# EasyEDA Pro project ProPrj_Hitboard PCB v2_left_2026-01-14.epro

# Board PCB1
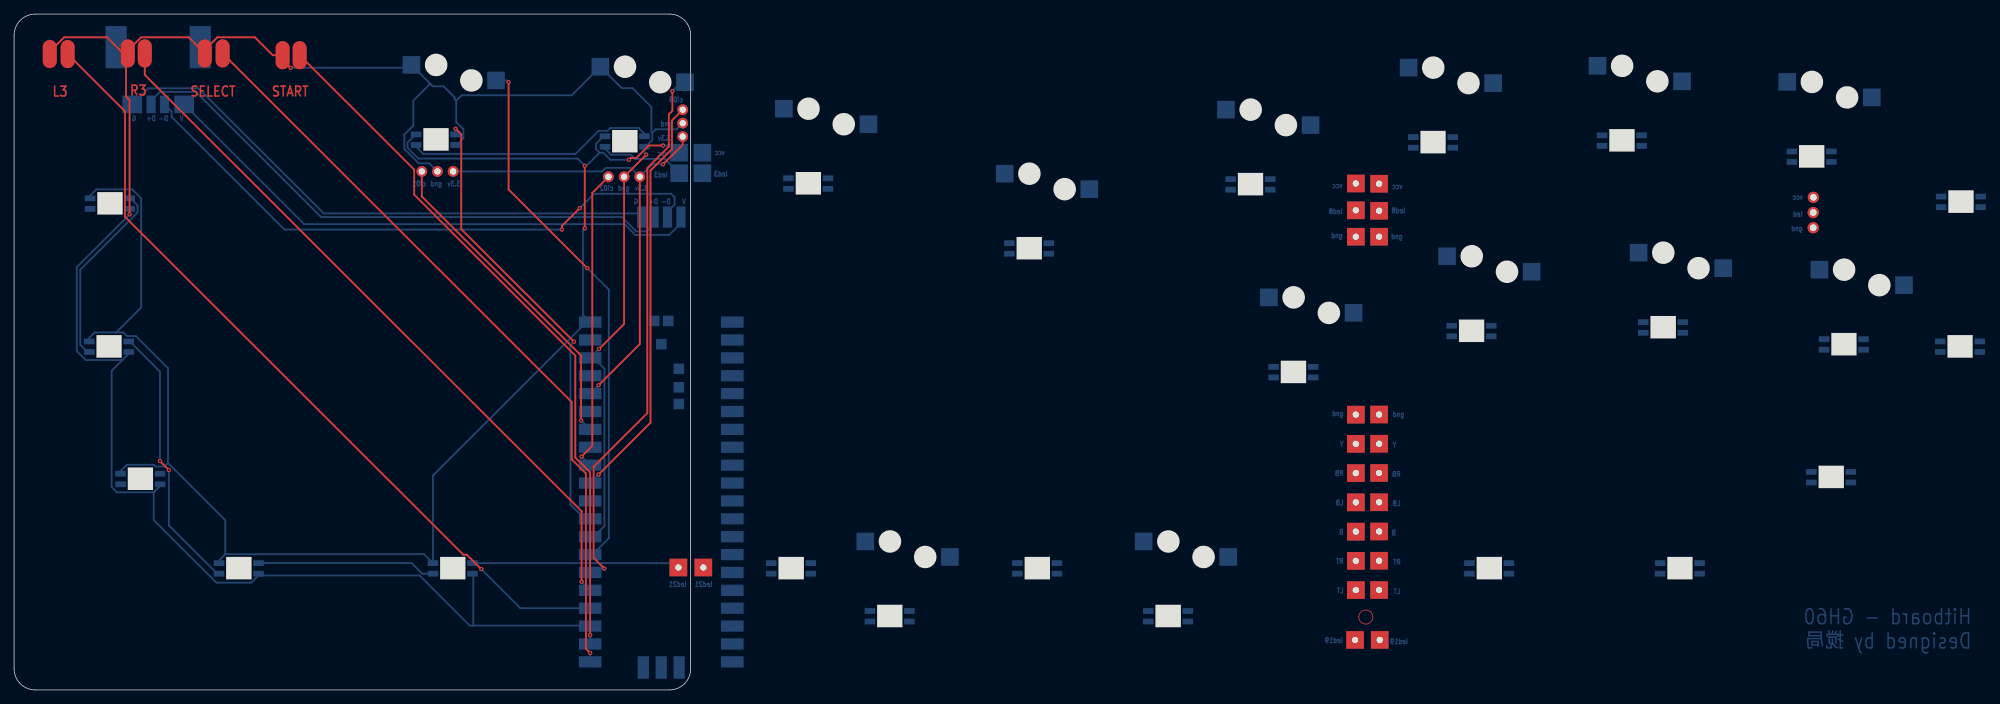
[diagram p0: board, top side]
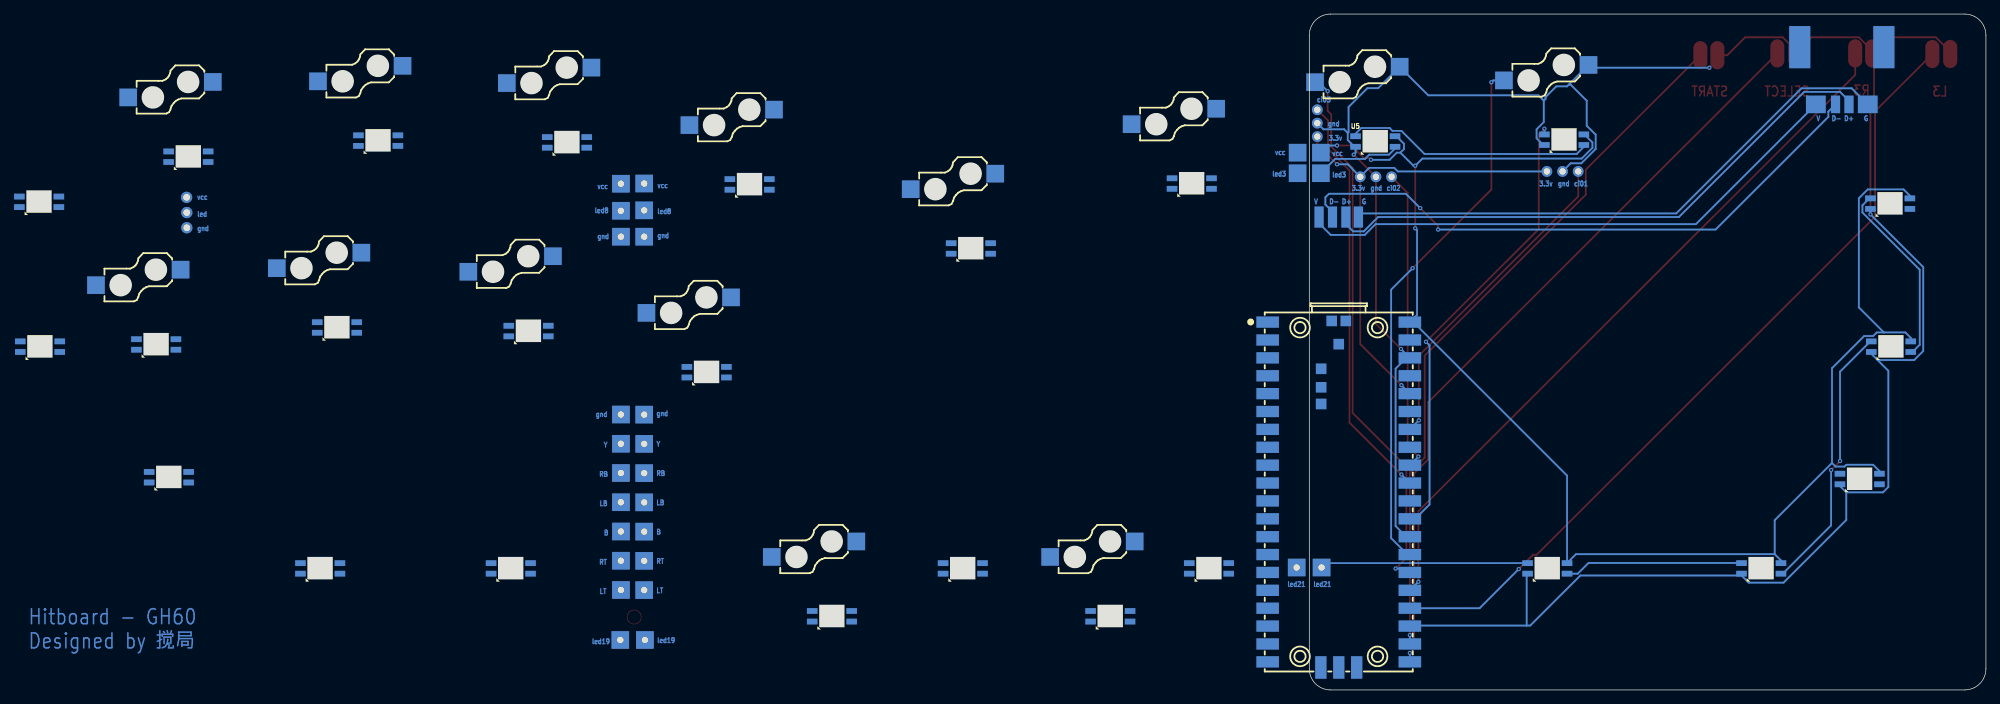
[diagram p1: board, bottom side, seen from below]

Outline 278.04 x 96 mm; copper layers: Top Layer, Bottom Layer. Coordinates in mm from the lower left corner of the outline.
Outline path: 0,93 0,3 arc(0.88,0.88) 3,0 93,0 arc(95.12,0.88) 96,3 96,93 arc(95.12,95.12) 93,96 3,96 arc(0.88,95.12) 0,93
Stack: Top Layer 0.035mm / Dielectric1 1.51mm FR4 er 4.5 / Bottom Layer 0.035mm

## Design rules (mm)
template: JLCPCB Capability(Two Layers Board)
spacing copperThickness1oz (default): track to track 0.102, other pairs 0.152 to 0.3
spacing copperThickness2oz: track to track 0.203, other pairs 0.152 to 0.3
track width copperThickness1oz (default): min 0.127, default 0.254, max 2.54
track width copperThickness2oz: min 0.203, default 0.254, max 2.54
differential pair differentialPair (default): width min 0.127, default 0.254, max 2.54; gap min 0.152, default 0.152
via viaSize (default): diameter min 0.5, default 0.61, max 10; hole min 0.3, default 0.305, max 6.3

## Placement (name value [footprint] x y rotation side)
NOREF  -  [Pad_e6738]  94.36 73.39 0 top
NOREF#2  -  [Pad_e13604]  190.37 30.8 0 top
NOREF#3  -  [Pad_e685]  21.34 83.17 180 top
NOREF#4  -  [Pad_e680]  29.59 90.41 0 top
NOREF#5  -  [Pad_e296]  60.07 73.65 0 top
NOREF#6  -  [Pad_e675]  5.06 90.32 0 top
NOREF#7  -  [Pad_e691]  90.81 67.17 180 top
NOREF#8  -  [Pad_e61147]  255.27 67.81 0 top
NOREF#9  -  [Pad_e677]  16.13 90.41 0 top
NOREF#10  -  [Pad_e13637]  193.68 71.9 0 top
NOREF#11  -  [Pad_e297]  57.85 73.65 0 top
NOREF#12  -  [Pad_e300]  94.87 80.51 0 top
NOREF#13  -  [Pad_e13608]  190.37 14.18 0 top
NOREF#14  -  [Pad_e678]  18.54 90.41 0 top
NOREF#15  -  [Pad_e73]  193.68 18.35 0 top
NOREF#16  -  [Pad_e687]  97.66 76.31 0 top
NOREF#17  -  [Pad_e13606]  190.37 22.49 0 top
NOREF#18  -  [Pad_e13605]  190.37 26.64 0 top
NOREF#19  -  [Pad_e6737]  97.66 73.39 0 top
NOREF#20  -  [Pad_e13607]  190.37 18.33 0 top
NOREF#21  -  [Pad_e13636]  193.68 64.38 0 top
NOREF#22  -  [Pad_e74]  193.68 14.2 0 top
NOREF#23  -  [Pad_e114539]  190.37 39.1 0 top
NOREF#24  -  [Pad_e686]  24.13 83.17 180 top
NOREF#25  -  [Pad_e4881]  97.79 17.39 0 top
NOREF#26  -  [Pad_e4875]  193.76 7.1 0 top
NOREF#27  -  [Pad_e693]  92.71 67.17 180 top
NOREF#28  -  [Pad_e681]  38.1 90.16 0 top
NOREF#29  -  [Pad_e71]  193.68 26.66 0 top
NOREF#30  -  [Pad_e70]  193.68 30.81 0 top
NOREF#31  -  [Pad_e301]  94.87 82.41 0 top
NOREF#32  -  [Pad_e294]  86.55 72.89 0 top
NOREF#33  -  [Pad_e46]  88.77 72.89 0 top
NOREF#34  -  [Pad_e676]  7.6 90.32 0 top
NOREF#35  -  [Pad_e4879]  94.26 17.39 0 top
NOREF#36  -  [Pad_e53994]  26.42 91.3 180 top
NOREF#37  -  [Pad_e48]  84.33 72.89 0 top
NOREF#38  -  [Pad_e13635]  193.68 68.06 0 top
NOREF#39  -  [Pad_e61148]  255.27 65.65 0 top
NOREF#40  -  [Pad_e299]  94.87 78.6 0 top
NOREF#41  -  [Pad_e68]  193.68 39.12 0 top
NOREF#42  -  [Pad_e689]  89.03 67.17 180 top
NOREF#43  -  [Pad_e684]  19.43 83.17 180 top
NOREF#44  -  [Pad_e13601]  190.37 68.12 0 top
NOREF#45  -  [Pad_e6736]  94.36 76.31 0 top
NOREF#46  -  [Pad_e295]  62.29 73.65 0 top
NOREF#47  -  [Pad_e61146]  255.3 69.97 0 top
NOREF#48  -  [Pad_e682]  40.51 90.16 0 top
NOREF#49  -  [Pad_e53995]  14.48 91.3 180 top
NOREF#50  -  [Pad_e72]  193.68 22.5 0 top
NOREF#51  -  [Pad_e683]  16.76 83.17 180 top
NOREF#52  -  [Pad_e4877]  190.27 7.1 0 top
NOREF#53  -  [Pad_e13600]  190.37 71.93 0 top
NOREF#54  -  [Pad_e679]  27.05 90.41 0 top
NOREF#55  -  [Pad_e13603]  190.37 34.95 0 top
NOREF#56  -  [Pad_e694]  94.61 67.17 180 top
NOREF#57  -  [Pad_e13602]  190.37 64.38 0 top
NOREF#58  -  [Pad_e69]  193.68 34.97 0 top
U1  PICO  [COMM-SMD_L51.0-W21.0-P2.54_SC0916]  91.82 27.8 270 bottom
U5  -  [LED-SMD_L3.2-W2.8_YO-WS2812B-3528]  163.73 10.46 180 bottom
U5#2  -  [LED-SMD_L3.2-W2.8_YO-WS2812B-3528]  144.02 62.7 180 bottom
U5#3  -  [LED-SMD_L3.2-W2.8_YO-WS2812B-3528]  276.23 69.33 180 bottom
U5#4  -  [LED-SMD_L3.2-W2.8_YO-WS2812B-3528]  276.1 48.76 180 bottom
U5#5  -  [LED-SMD_L3.2-W2.8_YO-WS2812B-3528]  257.81 30.21 180 bottom
U5#6  -  [LED-SMD_L3.2-W2.8_YO-WS2812B-3528]  209.3 17.26 180 bottom
U5#7  -  [LED-SMD_L3.2-W2.8_YO-WS2812B-3528]  145.16 17.26 180 bottom
U5#8  -  [LED-SMD_L3.2-W2.8_YO-WS2812B-3528]  110.24 17.26 180 bottom
U5#9  -  [LED-SMD_L3.2-W2.8_YO-WS2812B-3528]  62.23 17.26 180 bottom
U5#10  -  [LED-SMD_L3.2-W2.8_YO-WS2812B-3528]  31.88 17.26 180 bottom
U5#11  -  [LED-SMD_L3.2-W2.8_YO-WS2812B-3528]  13.46 48.76 180 bottom
U5#12  -  [LED-SMD_L3.2-W2.8_YO-WS2812B-3528]  13.59 69.08 180 bottom
U5#13  -  [LED-SMD_L3.2-W2.8_YO-WS2812B-3528]  17.91 29.96 180 bottom
U5#14  -  [LED-SMD_L3.2-W2.8_YO-WS2812B-3528]  236.35 17.26 180 bottom
U5#15  -  [LED-SMD_L3.2-W2.8_YO-WS2812B-3528]  59.84 78.15 180 bottom
U5#16  -  [LED-SMD_L3.2-W2.8_YO-WS2812B-3528]  86.64 77.9 180 bottom
U5#17  -  [LED-SMD_L3.2-W2.8_YO-WS2812B-3528]  112.68 71.93 180 bottom
U5#18  -  [LED-SMD_L3.2-W2.8_YO-WS2812B-3528]  124.23 10.46 180 bottom
U5#19  -  [LED-SMD_L3.2-W2.8_YO-WS2812B-3528]  175.41 71.8 180 bottom
U5#20  -  [LED-SMD_L3.2-W2.8_YO-WS2812B-3528]  181.51 45.13 180 bottom
U5#21  -  [LED-SMD_L3.2-W2.8_YO-WS2812B-3528]  201.32 77.77 180 bottom
U5#22  -  [LED-SMD_L3.2-W2.8_YO-WS2812B-3528]  206.78 50.97 180 bottom
U5#23  -  [LED-SMD_L3.2-W2.8_YO-WS2812B-3528]  228.12 78.03 180 bottom
U5#24  -  [LED-SMD_L3.2-W2.8_YO-WS2812B-3528]  233.96 51.48 180 bottom
U5#25  -  [LED-SMD_L3.2-W2.8_YO-WS2812B-3528]  255.04 75.74 180 bottom
U5#26  -  [LED-SMD_L3.2-W2.8_YO-WS2812B-3528]  259.62 49.07 180 bottom
U6  -  [CONN-SMD_HOTPLUGPAKAGE__C9900010116-1]  146.56 72.23 180 bottom
U6#2  -  [CONN-SMD_HOTPLUGPAKAGE__C9900010116-1]  62.38 87.68 180 bottom
U6#3  -  [CONN-SMD_HOTPLUGPAKAGE__C9900010116-1]  89.18 87.42 180 bottom
U6#4  -  [CONN-SMD_HOTPLUGPAKAGE__C9900010116-1]  115.22 81.45 180 bottom
U6#5  -  [CONN-SMD_HOTPLUGPAKAGE__C9900010116-1]  126.77 19.99 180 bottom
U6#6  -  [CONN-SMD_HOTPLUGPAKAGE__C9900010116-1]  166.27 19.99 180 bottom
U6#7  -  [CONN-SMD_HOTPLUGPAKAGE__C9900010116-1]  177.95 81.33 180 bottom
U6#8  -  [CONN-SMD_HOTPLUGPAKAGE__C9900010116-1]  184.05 54.66 180 bottom
U6#9  -  [CONN-SMD_HOTPLUGPAKAGE__C9900010116-1]  203.86 87.3 180 bottom
U6#10  -  [CONN-SMD_HOTPLUGPAKAGE__C9900010116-1]  209.32 60.5 180 bottom
U6#11  -  [CONN-SMD_HOTPLUGPAKAGE__C9900010116-1]  230.66 87.55 180 bottom
U6#12  -  [CONN-SMD_HOTPLUGPAKAGE__C9900010116-1]  236.5 61.01 180 bottom
U6#13  -  [CONN-SMD_HOTPLUGPAKAGE__C9900010116-1]  257.58 85.27 180 bottom
U6#14  -  [CONN-SMD_HOTPLUGPAKAGE__C9900010116-1]  262.16 58.59 180 bottom

## Footprints (pads in the part's own frame, mm; a bottom-side part is the same pattern mirrored in y, then rotated)
COMM-SMD_L51.0-W21.0-P2.54_SC0916
  rect 1.6x3.2 smd: 1(-24.445,-10.088) 2(-21.905,-10.088) 3(-19.365,-10.088) 4(-16.825,-10.088) 5(-14.285,-10.088) 6(-11.745,-10.088) 7(-9.205,-10.088) 8(-6.665,-10.088) 9(-4.125,-10.088) 10(-1.585,-10.088) 11(0.955,-10.088) 12(3.495,-10.088) 13(6.035,-10.088) 14(8.575,-10.088) 15(11.115,-10.088) 16(13.655,-10.088) 17(16.195,-10.088) 18(18.735,-10.088) 19(21.275,-10.088) 20(23.815,-10.088) 21(23.815,10.088) 22(21.275,10.088) 23(18.735,10.088) 24(16.195,10.088) 25(13.655,10.088) 26(11.115,10.088) 27(8.575,10.088) 28(6.035,10.088) 29(3.495,10.088) 30(0.955,10.088) 31(-1.585,10.088) 32(-4.125,10.088) 33(-6.665,10.088) 34(-9.205,10.088) 35(-11.745,10.088) 36(-14.285,10.088) 37(-16.825,10.088) 38(-19.365,10.088) 39(-21.905,10.088) 40(-24.445,10.088)
  rect 3.2x1.6 smd: 41(24.615,-2.54) 42(24.615,0) 43(24.615,2.54)
  rect 1.5x1.5 smd: TP1(-21.315,0) TP2(-24.615,1) TP3(-24.615,-1) TP4(-17.815,-2.5) TP5(-15.188,-2.5) TP6(-12.815,-2.5)
CONN-SMD_HOTPLUGPAKAGE__C9900010116-1
  rect 2.5x2.5 smd: 1(-6,-1.1) 2(6,1.1)
LED-SMD_L3.2-W2.8_YO-WS2812B-3528
  rect 1.5x0.82 smd: 1(2.8,0.75) 2(2.8,-0.75) 3(-2.8,-0.75) 4(-2.8,0.75)
Pad_e46
  round 1.524 hole 0.914: 1(0,0)
Pad_e48
  round 1.524 hole 0.914: 1(0,0)
Pad_e68
  rect 2.5x2.5 hole 0.9: PTH(0,0)
Pad_e69
  rect 2.5x2.5 hole 0.9: PTH(0,0)
Pad_e70
  rect 2.5x2.5 hole 0.9: PTH(0,0)
Pad_e71
  rect 2.5x2.5 hole 0.9: PTH(0,0)
Pad_e72
  rect 2.5x2.5 hole 0.9: PTH(0,0)
Pad_e73
  rect 2.5x2.5 hole 0.9: PTH(0,0)
Pad_e74
  rect 2.5x2.5 hole 0.9: PTH(0,0)
Pad_e294
  round 1.524 hole 0.914: 1(0,0)
Pad_e295
  round 1.524 hole 0.914: 1(0,0)
Pad_e296
  round 1.524 hole 0.914: 1(0,0)
Pad_e297
  round 1.524 hole 0.914: 1(0,0)
Pad_e299
  round 1.524 hole 0.914: 1(0,0)
Pad_e300
  round 1.524 hole 0.914: 1(0,0)
Pad_e301
  round 1.524 hole 0.914: 1(0,0)
Pad_e675
  oval 2x4 smd: 1(0,0)
Pad_e676
  oval 2x4 smd: 1(0,0)
Pad_e677
  oval 2x4 smd: 1(0,0)
Pad_e678
  oval 2x4 smd: 1(0,0)
Pad_e679
  oval 2x4 smd: 1(0,0)
Pad_e680
  oval 2x4 smd: 1(0,0)
Pad_e681
  oval 2x4 smd: 1(0,0)
Pad_e682
  oval 2x4 smd: 1(0,0)
Pad_e683
  rect 2.8x2.5 smd far side: PTH(0,0)
Pad_e684
  rect 1.3x2.5 smd far side: PTH(0,0)
Pad_e685
  rect 1.3x2.5 smd far side: PTH(0,0)
Pad_e686
  rect 2.8x2.5 smd far side: PTH(0,0)
Pad_e687
  rect 2.5x2.5 smd far side: PTH(0,0)
Pad_e689
  rect 1.3x3 smd far side: PTH(0,0)
Pad_e691
  rect 1.3x3 smd far side: PTH(0,0)
Pad_e693
  rect 1.3x3 smd far side: PTH(0,0)
Pad_e694
  rect 1.3x3 smd far side: PTH(0,0)
Pad_e4875
  rect 2.5x2.5 hole 0.9: PTH(0,0)
Pad_e4877
  rect 2.5x2.5 hole 0.9: PTH(0,0)
Pad_e4879
  rect 2.5x2.5 hole 0.9: PTH(0,0)
Pad_e4881
  rect 2.5x2.5 hole 0.9: PTH(0,0)
Pad_e6736
  rect 2.5x2.5 smd far side: PTH(0,0)
Pad_e6737
  rect 2.5x2.5 smd far side: PTH(0,0)
Pad_e6738
  rect 2.5x2.5 smd far side: PTH(0,0)
Pad_e13600
  rect 2.5x2.5 hole 0.9: PTH(0,0)
Pad_e13601
  rect 2.5x2.5 hole 0.9: PTH(0,0)
Pad_e13602
  rect 2.5x2.5 hole 0.9: PTH(0,0)
Pad_e13603
  rect 2.5x2.5 hole 0.9: PTH(0,0)
Pad_e13604
  rect 2.5x2.5 hole 0.9: PTH(0,0)
Pad_e13605
  rect 2.5x2.5 hole 0.9: PTH(0,0)
Pad_e13606
  rect 2.5x2.5 hole 0.9: PTH(0,0)
Pad_e13607
  rect 2.5x2.5 hole 0.9: PTH(0,0)
Pad_e13608
  rect 2.5x2.5 hole 0.9: PTH(0,0)
Pad_e13635
  rect 2.5x2.5 hole 0.9: PTH(0,0)
Pad_e13636
  rect 2.5x2.5 hole 0.9: PTH(0,0)
Pad_e13637
  rect 2.5x2.5 hole 0.9: PTH(0,0)
Pad_e53994
  rect 3x6 smd far side: PTH(0,0)
Pad_e53995
  rect 3x6 smd far side: PTH(0,0)
Pad_e61146
  round 1.6 hole 0.96: PTH(0,0)
Pad_e61147
  round 1.6 hole 0.96: PTH(0,0)
Pad_e61148
  round 1.6 hole 0.96: PTH(0,0)
Pad_e114539
  rect 2.5x2.5 hole 0.9: PTH(0,0)

## Nets
3V3: NOREF#33.1 NOREF#40.1 NOREF#46.1 U1.36
GND: NOREF#5.1 NOREF#6.1 NOREF#9.1 NOREF#12.1 NOREF#21.PTH NOREF#23.PTH NOREF#28.1 NOREF#32.1 NOREF#39.PTH NOREF#41.PTH NOREF#54.1 NOREF#57.PTH U1.3 U1.8 U1.18 U1.23 U1.28 U1.38 U5.3 U5#2.3 U5#3.3 U5#4.3 U5#5.3 U5#6.3 U5#7.3 U5#8.3 U5#9.3 U5#10.3 U5#11.3 U5#12.3 U5#13.3 U5#14.3 U5#15.3 U5#16.3 U5#17.3 U5#18.3 U5#19.3 U5#20.3 U5#21.3 U5#22.3 U5#23.3 U5#24.3 U5#25.3 U5#26.3 U6.2 U6#2.2 U6#3.2 U6#4.2 U6#5.2 U6#6.2 U6#7.2 U6#8.2 U6#9.2 U6#10.2 U6#11.2 U6#12.2 U6#13.2 U6#14.2
VCC: NOREF#10.PTH NOREF#16.PTH NOREF#45.PTH NOREF#47.PTH NOREF#53.PTH U1.40 U5.1 U5#2.1 U5#3.1 U5#4.1 U5#5.1 U5#6.1 U5#7.1 U5#8.1 U5#9.1 U5#10.1 U5#11.1 U5#12.1 U5#13.1 U5#14.1 U5#15.1 U5#16.1 U5#17.1 U5#18.1 U5#19.1 U5#20.1 U5#21.1 U5#22.1 U5#23.1 U5#24.1 U5#25.1 U5#26.1
2: U5#15.2 U5#16.4
3: NOREF.PTH NOREF#19.PTH U5#2.4 U5#16.2 U5#17.4
4: U5#2.2 U5#17.2 U5#18.4
5: U5.4 U5#18.2
6: U5.2 U5#19.4
7: U5#19.2 U5#20.4
8: NOREF#38.PTH NOREF#44.PTH U5#20.2 U5#21.4
9: U5#21.2 U5#22.4
10: U5#22.2 U5#23.4
11: U5#23.2 U5#24.4
12: U5#24.2 U5#25.4
13: U5#25.2 U5#26.4
14: NOREF#8.PTH U5#3.4 U5#13.4 U5#26.2
15: U5#3.2 U5#4.4 U5#13.2
16: U5#4.2 U5#5.4
17: U5#5.2 U5#14.4
18: U5#6.4 U5#14.2
19: NOREF#26.PTH NOREF#52.PTH U5#6.2 U5#7.4
20: U5#7.2 U5#8.4
21: NOREF#25.PTH NOREF#35.PTH U5#8.2 U5#9.4
22: U5#9.2 U5#10.4
23: U5#10.2 U5#11.4
24: U5#11.2 U5#12.4
25: U5#12.2
A: U1.9 U6#8.1
B: NOREF#17.PTH NOREF#50.PTH U1.10 U6#10.1
BUTTON1: U1.5 U6#5.1
BUTTON2: U1.7 U6.1
D+: NOREF#7.PTH NOREF#43.PTH
D-: NOREF#3.PTH NOREF#27.PTH
DOWN: U1.26 U6#3.1
G: NOREF#42.PTH NOREF#51.PTH
L3: NOREF#34.1 U1.24
LB: NOREF#18.PTH NOREF#29.PTH U1.17 U6#13.1
LED1: U1.29 U5#15.4
LEFT: U1.27 U6#2.1
LINEBUTTON01: NOREF#11.1 U1.34
LINEBUTTON02: NOREF#37.1 U1.32
LINEBUTTON03: NOREF#31.1 U1.31
LT: NOREF#13.PTH NOREF#22.PTH U1.12 U6#14.1
R3: NOREF#14.1 U1.25
RB: NOREF#2.PTH NOREF#30.PTH U1.16 U6#11.1
RIGHT: U1.6 U6#4.1
RT: NOREF#15.PTH NOREF#20.PTH U1.11 U6#12.1
SELECT: NOREF#4.1 U1.21
START: NOREF#48.1 U1.22
UP: U1.4 U6#6.1
V: NOREF#24.PTH NOREF#56.PTH
X: U1.14 U6#7.1
Y: NOREF#55.PTH NOREF#58.PTH U1.15 U6#9.1

Pads without a net: NOREF#36 PTH; NOREF#49 PTH; U1 1 2 13 19 20 30 33 35 37 39 41 42 43 TP1 TP2 TP3 TP4 TP5 TP6

## Via types
v1: diameter 0.61, hole 0.305, Top Layer to Bottom Layer, 27 vias

## Routing (per net, layer and track width the routed paths; a pad name or vN(x,y) marks a point on that pad's centre or on a via; arc(x,y) is an arc through that point)
3V3: length 70.1
  Top Layer w0.254: v1(92.08,74.66) 94.87,77.46 NOREF#40.1 ; v1(82.93,43.28) 88.77,49.13 NOREF#33.1
  Bottom Layer w0.254: NOREF#46.1 83.44,73.65 83.95,74.16 87.5,74.16 NOREF#33.1 90.55,74.66 v1(92.08,74.66) ; v1(82.93,43.28) U1.36
GND: length 358.2
  Top Layer w0.254: 37.97,90.16 NOREF#28.1 ; 37.97,90.16 37.97,89.65 v1(39.24,88.38) ; 37.97,90.16 36.7,90.16 34.16,92.7 28.83,92.7 27.05,90.92 NOREF#54.1 24.77,92.7 18.02,92.7 15.98,90.67 15.98,90.41 ; 15.98,90.41 15.48,90.41 13.19,92.7 7.09,92.7 5.06,90.67 NOREF#6.1 ; 15.98,90.41 NOREF#9.1 15.88,90.16 15.88,84.32 16.38,83.81 v1(16.38,67.55) ; v1(89.7,76.03) NOREF#32.1 86.55,51.98 v1(82.99,48.43)
  Bottom Layer w0.254: 19.81,28.06 19.81,24.13 28.7,15.24 33.66,15.24 34.68,16.26 ; 19.81,28.06 20.71,28.96 U5#13.3 ; 19.81,28.06 14.61,28.06 13.84,28.82 13.84,45.33 15.37,46.86 ; 15.37,46.86 10.17,46.86 8.9,48.13 8.9,60.06 v1(16.38,67.55) 16.38,68.32 ; 15.37,46.86 16.26,47.75 U5#11.3 ; U1.23 81.66,9.14 65.16,9.14 ; NOREF#12.1 94,79.63 91.06,79.63 90.55,79.13 ; NOREF#5.1 58.91,74.81 57.4,74.81 55.37,76.84 55.37,78.87 56.64,80.14 56.64,83.7 58.92,85.98 59.18,85.98 ; 34.68,16.26 57.54,16.26 64.65,9.14 65.16,9.14 ; 34.68,16.26 U5#10.3 ; 62.73,83.7 62.73,80.65 63.75,79.63 63.75,78.36 62.79,77.4 U5#15.3 ; 62.73,83.7 62.48,83.95 62.48,84.21 60.96,85.73 59.43,85.73 59.18,85.98 ; 62.73,83.7 63.5,84.46 79.12,84.46 U6#3.2 86.23,85.48 87.75,85.48 90.43,82.8 90.43,79.24 90.55,79.13 ; v1(89.7,76.03) 89.44,76.28 U5#16.3 89.59,77.15 90.55,78.11 90.55,79.13 ; 65.16,9.14 65.16,16.38 U5#9.3 ; 81.98,47.41 U1.38 ; 81.98,47.41 v1(82.99,48.43) ; 81.98,47.41 83.76,45.63 83.76,23.28 82.24,21.77 U1.28 ; 59.18,85.98 U6#2.2 55.99,88.38 v1(39.24,88.38)
VCC: length 226.5
  Top Layer w0.254: v1(80.97,74.46) v1(80.97,65.57) ; v1(92.08,77.33) 90.04,77.33 88.27,75.55 87.5,75.55 v1(87.25,75.3)
  Bottom Layer w0.254: v1(92.08,77.33) 93.34,77.33 NOREF#45.PTH ; U5#16.1 83.64,78.65 82.57,77.58 82.57,76.82 83.08,76.31 ; 21.84,32.23 29.97,24.11 29.97,19.28 ; 21.84,32.23 21.84,45.7 17.27,50.27 16,50.27 15.49,50.78 14.47,50.78 ; 21.84,32.23 21.33,31.73 20.06,31.73 19.81,31.98 16,31.98 15.11,31.09 U5#13.1 ; 29.08,18.01 29.08,18.39 29.97,19.28 ; U5#12.1 10.79,70.21 11.68,71.1 16.76,71.1 18.03,69.83 18.03,54.33 14.47,50.78 ; U5#15.1 56.97,78.9 55.83,77.76 55.83,77 57.35,75.48 79.96,75.48 v1(80.97,74.46) 81.23,74.46 83.08,76.31 ; 29.97,19.28 58.16,19.28 U5#9.1 59.43,30.45 81.23,52.25 U1.40 80.72,53.26 80.72,65.32 v1(80.97,65.57) ; U5#11.1 10.66,50.01 11.42,50.78 14.47,50.78 ; v1(87.25,75.3) 84.6,75.3 83.59,76.31 83.08,76.31
2: length 35.3
  Bottom Layer w0.254: U5#16.4 89.44,78.99 88.62,79.82 84.61,79.82 84.2,79.41 82.93,79.41 79.65,76.13 58.06,76.13 57.04,77.15 U5#15.2
3: length 12.2
  Bottom Layer w0.254: U5#16.2 83.84,76.89 84.71,76.03 87.5,76.03 88.1,75.43 92.33,75.43 NOREF.PTH
21: length 29.5
  Bottom Layer w0.254: NOREF#35.PTH 93.64,18.01 U5#9.4
22: length 25.4
  Bottom Layer w0.254: U5#10.4 34.7,18.03 56.38,18.03 57.91,16.51 U5#9.2
23: length 38.5
  Top Layer w0.254: v1(21.96,31.24) v1(20.7,32.51)
  Bottom Layer w0.254: U5#11.4 16.36,49.41 16.5,49.41 20.7,45.21 v1(20.7,32.51) ; 29.08,16.51 28.82,16.51 21.96,23.37 v1(21.96,31.24)
24: length 26.4
  Bottom Layer w0.254: U5#12.4 16.48,69.73 16.62,69.73 17.52,68.83 17.52,67.82 9.39,59.69 9.39,49.02 10.41,48.01 U5#11.2
D+: length 82.1
  Bottom Layer w0.254: NOREF#7.PTH 90.81,66.16 89.79,65.14 88.27,65.14 86.23,67.17 43.56,67.17 25.78,84.95 20.7,84.95 19.43,83.68 NOREF#43.PTH
D-: length 86
  Top Layer w0.254: v1(77.72,65.39) 77.72,65.9 v1(80.26,68.44)
  Bottom Layer w0.254: v1(77.72,65.39) 38.35,65.39 22.35,81.39 22.35,82.16 NOREF#3.PTH ; NOREF#27.PTH 92.71,67.93 93.73,68.95 93.73,69.97 93.22,70.47 82.3,70.47 v1(80.26,68.44)
DOWN: length 77.6
  Top Layer w0.254: v1(83.75,17.24) 82.23,18.76 82.23,31.71 89.85,39.33 89.85,74.13 92.9,77.18 92.9,81.75 93.4,82.26 v1(93.4,85.05)
  Bottom Layer w0.254: U6#3.1 94.67,86.32 v1(93.4,85.05) ; U1.26 82.28,17.24 v1(83.75,17.24)
G: length 80.8
  Bottom Layer w0.254: NOREF#51.PTH 19.05,85.46 26.16,85.46 43.94,67.68 88.52,67.68 NOREF#42.PTH
L3: length 115.5
  Top Layer w0.254: v1(66.28,17.17) 64.24,19.2 63.74,19.2 15.73,67.21 15.73,82.19 NOREF#34.1
  Bottom Layer w0.254: U1.24 71.84,11.61 v1(66.28,17.17)
LED1: length 65
  Top Layer w0.254: v1(62.64,79.72) 63.45,78.92 63.45,65.45 v1(79.45,49.45)
  Bottom Layer w0.254: v1(79.45,49.45) 78.94,48.94 78.94,26.34 80.97,24.31 U1.29 ; v1(62.64,79.72) U5#15.4
LEFT: length 76.2
  Top Layer w0.254: v1(81.34,59.91) 70.16,71.08 v1(70.16,86.32)
  Bottom Layer w0.254: U6#2.1 69.91,86.58 v1(70.16,86.32) ; U1.27 82.06,19.23 84.39,21.55 84.39,56.86 v1(81.34,59.91)
LINEBUTTON01: length 46.5
  Top Layer w0.254: v1(80.45,38.29) 80.45,47.49 57.85,70.09 NOREF#11.1
  Bottom Layer w0.254: v1(80.45,38.29) U1.34
LINEBUTTON02: length 43
  Top Layer w0.254: v1(80.52,33.14) 82.04,34.67 82.04,70.6 NOREF#37.1
  Bottom Layer w0.254: v1(80.52,33.14) U1.32
LINEBUTTON03: length 58.5
  Top Layer w0.254: NOREF#31.1 93.34,80.89 93.34,76.82 90.3,73.78 90.3,37.96 v1(82.93,30.59)
  Bottom Layer w0.254: v1(82.93,30.59) 82.93,30.58 U1.31
R3: length 102.4
  Top Layer w0.254: NOREF#14.1 18.54,87.36 80.52,25.39 v1(80.52,15.36)
  Bottom Layer w0.254: v1(80.52,15.36) U1.25
SELECT: length 108
  Top Layer w0.254: NOREF#4.1 79.12,40.88 79.12,32.75 81.13,30.75 81.13,5.86 v1(81.73,5.25)
  Bottom Layer w0.254: v1(81.73,5.25) U1.21
START: length 100.7
  Top Layer w0.254: v1(81.73,7.79) 81.73,30.9 79.63,33.01 79.63,47.49 56.77,70.35 56.77,73.9 NOREF#48.1
  Bottom Layer w0.254: v1(81.73,7.79) U1.22
V: length 79.7
  Bottom Layer w0.254: NOREF#56.PTH 94.61,66.28 92.96,64.63 88.14,64.63 86.61,66.16 41.15,66.16 NOREF#24.PTH

## Text on the board
Bottom Layer: G | D+ | D- | V | ci01 | gnd | 3.3v | ci02 | vcc | led3 | ci03 | led21 | led8 | led19 | Y | RB | LB | B | RT | LT | led | Hitboard - GH60 / Designed by 搅局
Top Layer: L3 | R3 | SELECT | START
